# EAGLE design Tarjeta48_48 (EAGLE 7.4.0)
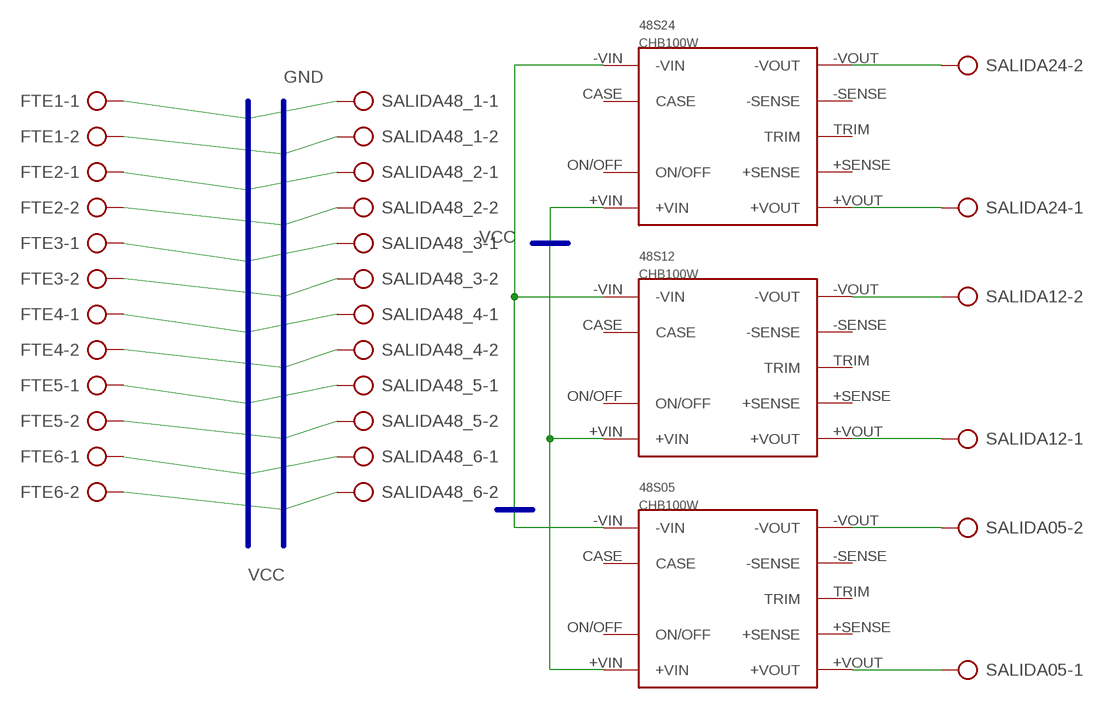
[diagram p0: schematic, sheet 1]

## Parts
48S05  CHB100W  [CHB]
48S12  CHB100W  [CHB]
48S24  CHB100W  [CHB]
FTE1  AK500/2-H  [AK500/2-H]
FTE2  AK500/2-H  [AK500/2-H]
FTE3  AK500/2-H  [AK500/2-H]
FTE4  AK500/2-H  [AK500/2-H]
FTE5  AK500/2-H  [AK500/2-H]
FTE6  AK500/2-H  [AK500/2-H]
SALIDA05  AK500/2-H  [AK500/2-H]
SALIDA12  AK500/2-H  [AK500/2-H]
SALIDA24  AK500/2-H  [AK500/2-H]
SALIDA48_1  AK500/2-H  [AK500/2-H]
SALIDA48_2  AK500/2-H  [AK500/2-H]
SALIDA48_3  AK500/2-H  [AK500/2-H]
SALIDA48_4  AK500/2-H  [AK500/2-H]
SALIDA48_5  AK500/2-H  [AK500/2-H]
SALIDA48_6  AK500/2-H  [AK500/2-H]

## Nets
GND: 48S05.-VIN 48S12.-VIN 48S24.-VIN FTE1.2 FTE2.2 FTE3.2 FTE4.2 FTE5.2 FTE6.2 SALIDA48_1.2 SALIDA48_2.2 SALIDA48_3.2 SALIDA48_4.2 SALIDA48_5.2 SALIDA48_6.2
N$1: 48S05.+VOUT SALIDA05.1
N$2: 48S05.-VOUT SALIDA05.2
N$3: 48S12.+VOUT SALIDA12.1
N$4: 48S12.-VOUT SALIDA12.2
N$5: 48S24.+VOUT SALIDA24.1
N$6: 48S24.-VOUT SALIDA24.2
VCC: 48S05.+VIN 48S12.+VIN 48S24.+VIN FTE1.1 FTE2.1 FTE3.1 FTE4.1 FTE5.1 FTE6.1 SALIDA48_1.1 SALIDA48_2.1 SALIDA48_3.1 SALIDA48_4.1 SALIDA48_5.1 SALIDA48_6.1
Unconnected: 48S05.+SENSE 48S05.-SENSE 48S05.CASE 48S05.ON/OFF 48S05.TRIM 48S12.+SENSE 48S12.-SENSE 48S12.CASE 48S12.ON/OFF 48S12.TRIM 48S24.+SENSE 48S24.-SENSE 48S24.CASE 48S24.ON/OFF 48S24.TRIM

## Buses
VCC
GND

## Library data of the parts
48S05 48S12 48S24 = Minero:CHB100W: CHB100W DC-DC Converter
FTE1-FTE6 SALIDA05 SALIDA12 SALIDA24 SALIDA48_1-SALIDA48_6 = con-ptr500:AK500/2-H: CONNECTOR Aug. 2004 / PTR Meßtechnik: Die Bezeichnung der Serie AK505 wurde geändert. Es handelt sich hierbei um AK500 in horizontaler Ausführung.; OC_FARNELL: unknown; OC_NEWARK: unknown

## Board
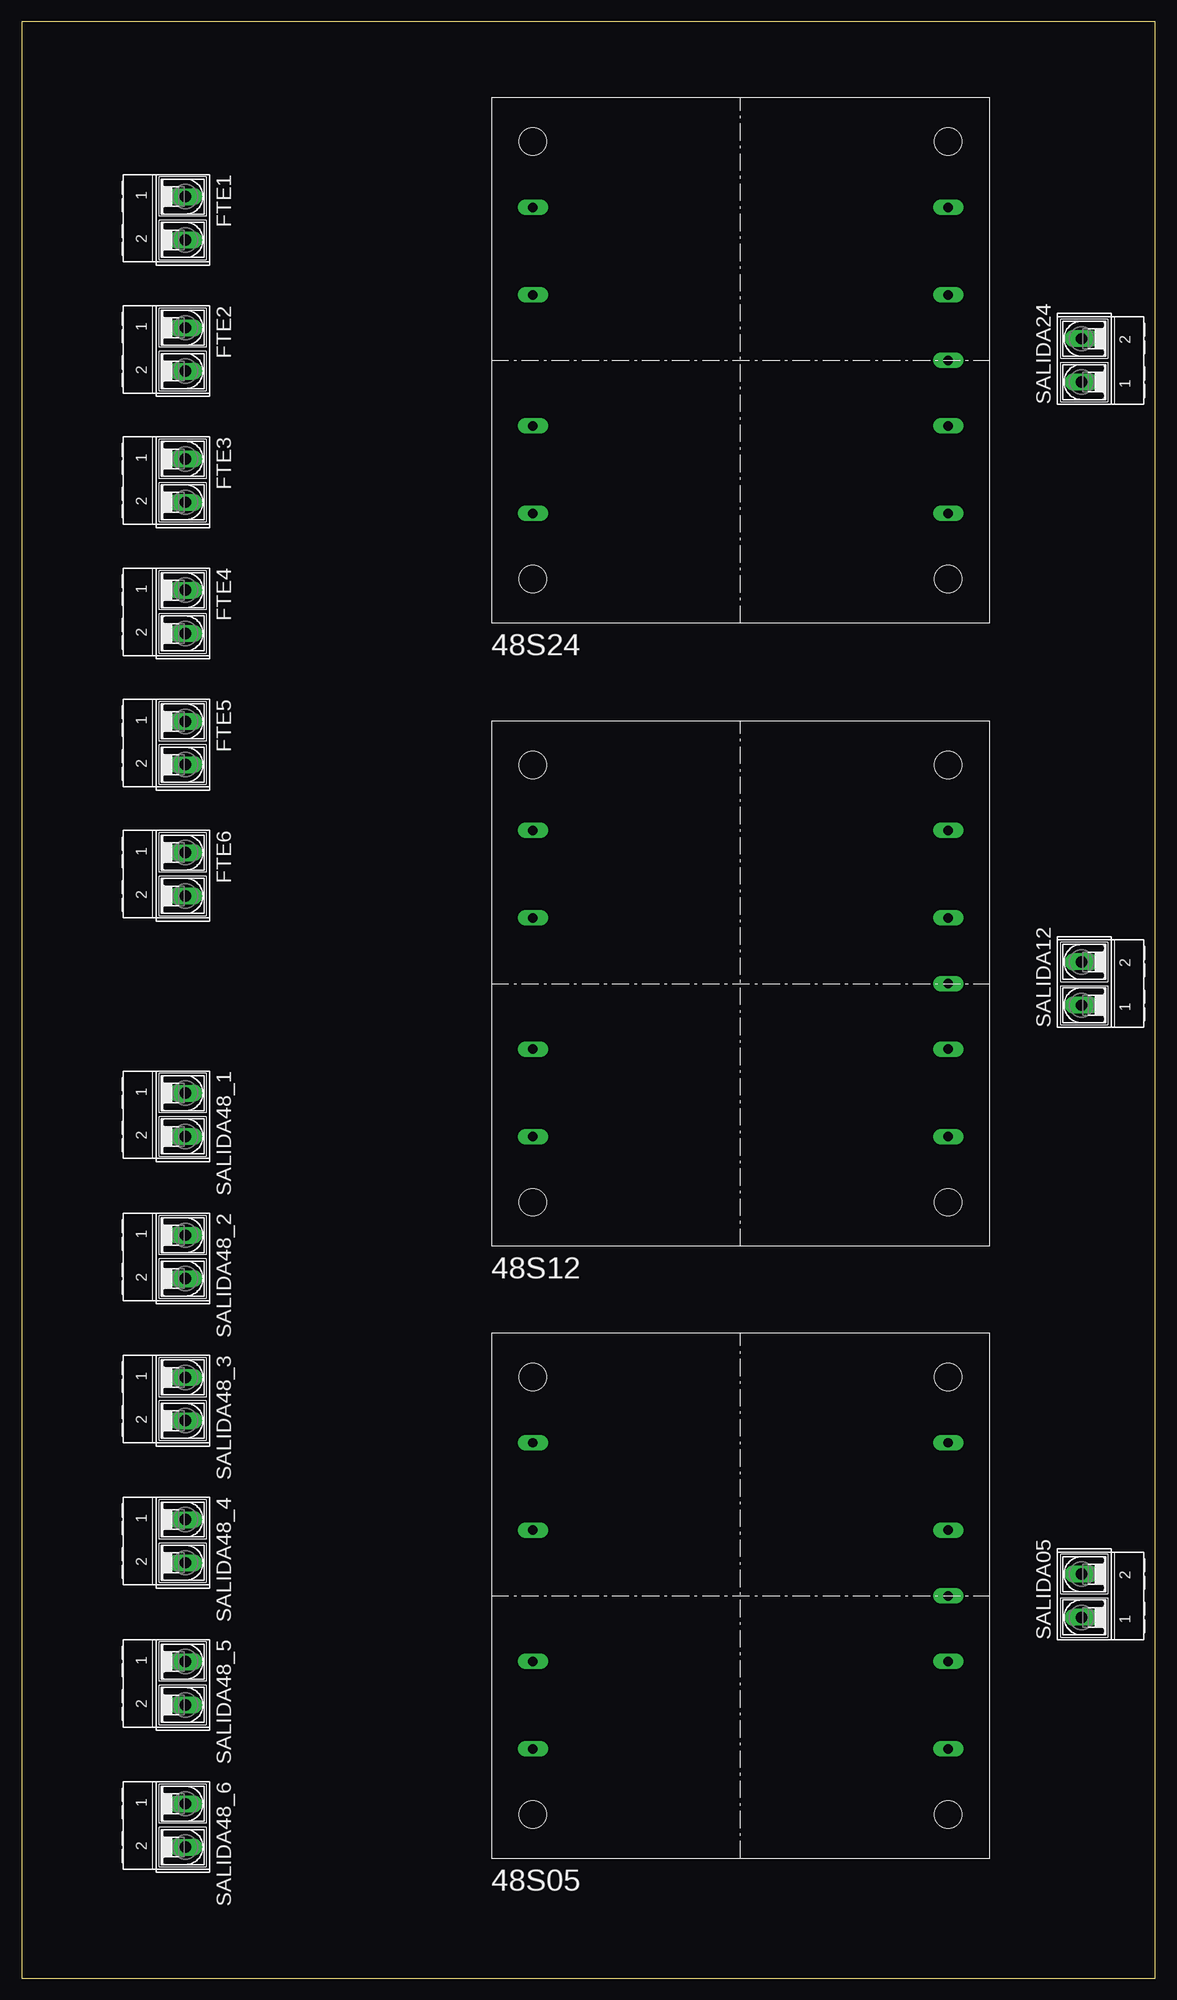
[diagram p1: board, top side]
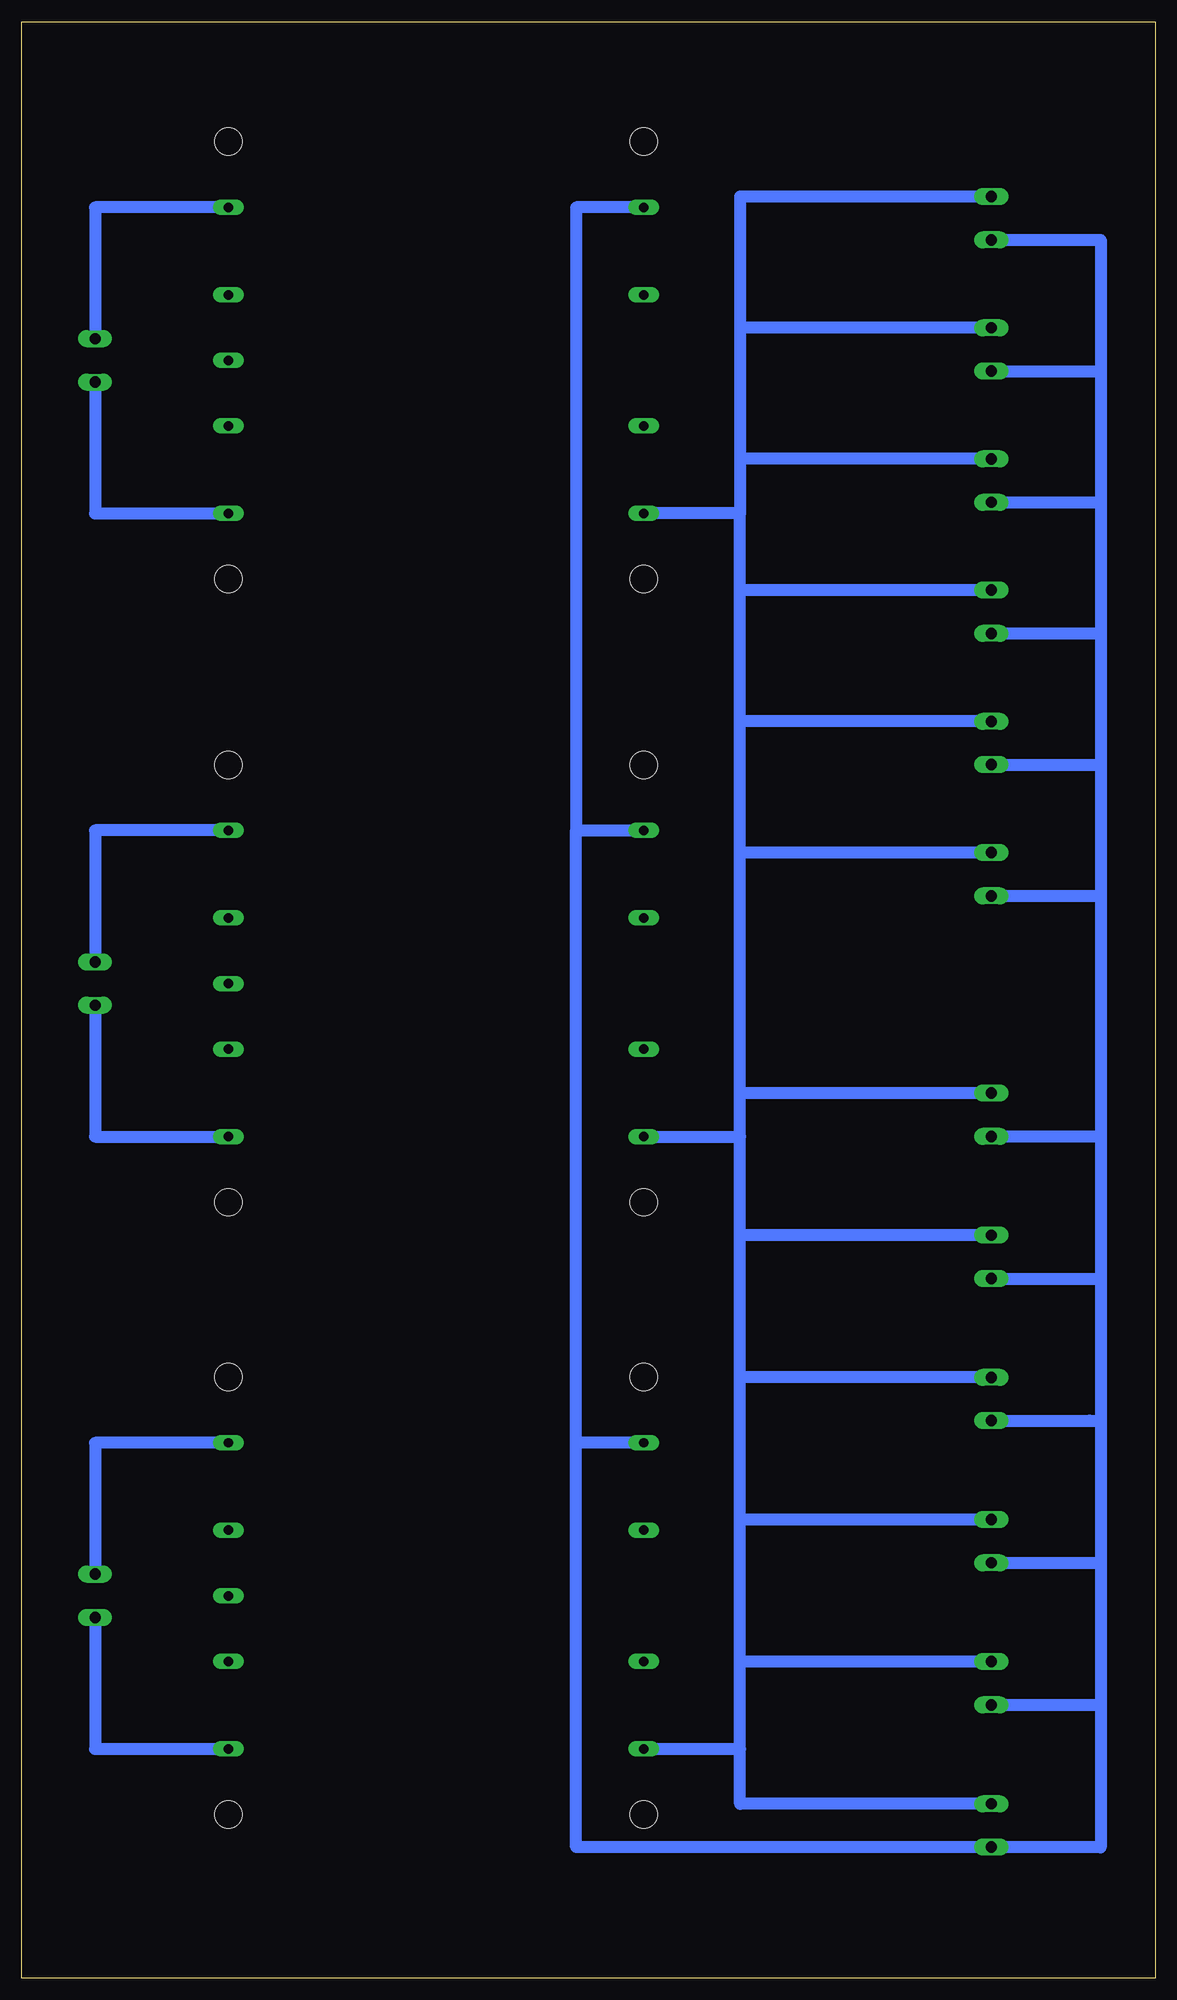
[diagram p2: board, bottom side, seen from below]

Size 131.75 x 227.32 mm. Coordinates in mm from the lower left corner, seen from the top.
Outline: 0,0 131.75,0 131.75,227.32 0,227.32 0,0
Copper layers (1*16): Top 0.035mm / dielectric 1.5mm / Bottom 0.035mm
Design rules "default": minimum track width 10mil, minimum drill 24mil, track to track 8mil, track to pad 8mil, pad to pad 8mil, via to via 8mil, smd to smd 8mil, copper to edge 40mil, drill to drill 8mil, minimum pad ring 10mil, minimum via ring 8mil, stop-mask expansion 4mil, vias tented up to drill 0mil, thermal gap 10mil

### Footprints (pad centres in the part's own frame; a part is rotated, then mirrored left to right if it is on the bottom)
CHB = drill 1.1 pad 1.778 long: +SENSE 53.086,22.86; +VIN 4.826,12.7; +VOUT 53.086,12.7; -SENSE 53.086,38.1; -VIN 4.826,48.26; -VOUT 53.086,48.26; CASE 4.826,38.1; ON/OFF 4.826,22.86; TRIM 53.086,30.48 | hole 3.2: 4.826,5.08; 4.826,55.88; 53.086,55.88; 53.086,5.08
AK500/2-H = drill 1.321 long: 1 -2.515,0; 2 2.515,0

### Placement (x,y rotation side)
48S05  54.61,13.97 0 top
48S12  54.61,85.09 0 top
48S24  54.61,157.48 0 top
FTE1  19.05,204.47 270 top
FTE2  19.05,189.23 270 top
FTE3  19.05,173.99 270 top
FTE4  19.05,158.75 270 top
FTE5  19.05,143.51 270 top
FTE6  19.05,128.27 270 top
SALIDA05  123.19,44.45 90 top
SALIDA12  123.19,115.57 90 top
SALIDA24  123.19,187.96 90 top
SALIDA48_1  19.05,100.33 270 top
SALIDA48_2  19.05,83.82 270 top
SALIDA48_3  19.05,67.31 270 top
SALIDA48_4  19.05,50.8 270 top
SALIDA48_5  19.05,34.29 270 top
SALIDA48_6  19.05,17.78 270 top

### Tracks (layer width: path | path; a pad name or v marks a point on that pad's centre or on a via)
GND
  Bottom 1.422: 48S24.-VIN 67.31,205.74 67.31,133.35 | 67.31,133.35 48S12.-VIN | 48S05.-VIN 67.31,62.23 | 67.31,62.23 67.31,133.35 | FTE1.2 6.35,201.96 6.35,186.72 | 6.35,186.72 6.35,171.47 | 6.35,171.47 6.35,156.24 | 6.35,156.24 6.35,141 | 6.35,141 6.35,125.75 | 6.35,125.75 6.35,97.81 | 6.35,97.81 6.35,81.31 | 6.35,81.31 6.35,64.77 | 6.35,64.77 6.35,48.28 | 6.35,48.28 6.35,31.77 | 6.35,31.77 6.35,15.24 19.05,15.24 SALIDA48_6.2 67.31,15.27 67.31,62.23 | FTE2.2 6.35,186.72 | FTE3.2 6.35,171.47 | FTE4.2 6.35,156.24 | FTE5.2 6.35,141 | FTE6.2 6.35,125.75 | SALIDA48_2.2 6.35,81.31 | SALIDA48_3.2 7.62,64.8 7.62,64.77 6.35,64.77 | SALIDA48_4.2 6.35,48.28 | SALIDA48_5.2 6.35,31.77 | SALIDA48_1.2 6.35,97.81
N$1
  Bottom 1.422: SALIDA05.1 123.19,26.67 48S05.+VOUT
N$2
  Bottom 1.422: 48S05.-VOUT 123.19,62.23 SALIDA05.2
N$3
  Bottom 1.422: SALIDA12.1 123.19,97.79 48S12.+VOUT
N$4
  Bottom 1.422: 48S12.-VOUT 123.19,133.35 SALIDA12.2
N$5
  Bottom 1.422: SALIDA24.1 123.19,170.18 48S24.+VOUT
N$6
  Bottom 1.422: 48S24.-VOUT 123.19,205.74 SALIDA24.2
VCC
  Bottom 1.422: FTE1.1 48.26,206.99 48.26,191.75 | 48.26,191.75 48.26,176.5 | 48.26,176.5 48.26,170.18 | 48.26,170.18 48S24.+VIN | FTE2.1 48.26,191.75 | FTE3.1 48.26,176.5 | FTE4.1 48.26,161.26 | 48.26,161.26 48.26,170.18 | FTE6.1 48.26,130.78 | 48.26,130.78 48.26,146.03 | 48.26,146.03 48.26,161.26 | FTE5.1 48.26,146.03 | SALIDA48_1.1 48.26,102.84 | 48.26,102.84 48.26,130.78 | SALIDA48_3.1 48.26,69.83 | 48.26,69.83 48.26,86.33 | 48.26,86.33 48.26,97.79 | 48.26,97.79 48.26,102.84 | 48S12.+VIN 48.26,97.79 | SALIDA48_4.1 48.26,53.31 | 48.26,53.31 48.26,69.83 | SALIDA48_5.1 48.26,36.8 | 48.26,36.8 48.26,53.31 | 48S05.+VIN 48.26,26.67 | 48.26,26.67 48.26,36.8 | SALIDA48_6.1 48.26,20.3 48.26,26.67 | SALIDA48_2.1 48.26,86.33